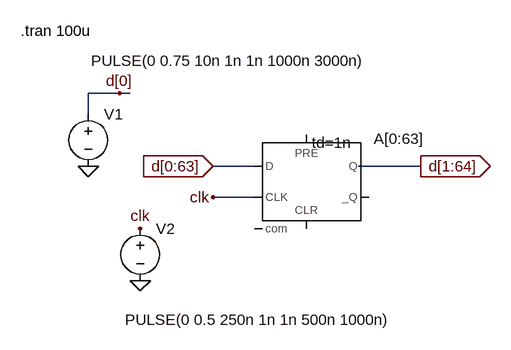
[diagram p0: schematic shiftreg64[1].asc]
shiftreg64[1].asc, the LTspice schematic file:
Version 4
SHEET 1 944 680
WIRE -96 -80 -144 -80
WIRE -80 -80 -96 -80
WIRE -144 -48 -144 -80
WIRE 112 32 48 32
WIRE 368 32 272 32
WIRE 112 80 48 80
FLAG 48 32 d[0:63]
IOPIN 48 32 In
FLAG 48 80 clk
FLAG -144 32 0
FLAG -64 208 0
FLAG -64 128 clk
FLAG -96 -80 d[0]
FLAG 368 32 d[1:64]
IOPIN 368 32 Out
SYMBOL Digital\\dflop 192 -16 R0
WINDOW 3 8 12 Left 0
SYMATTR Value td=1n
SYMATTR InstName A[0:63]
SYMBOL voltage -144 -64 R0
WINDOW 3 4 -66 Left 0
WINDOW 123 0 0 Left 0
WINDOW 39 0 0 Left 0
SYMATTR Value PULSE(0 0.75 10n 1n 1n 1000n 3000n)
SYMATTR InstName V1
SYMBOL voltage -64 112 R0
WINDOW 3 -23 156 Left 0
WINDOW 123 0 0 Left 0
WINDOW 39 0 0 Left 0
SYMATTR Value PULSE(0 0.5 250n 1n 1n 500n 1000n)
SYMATTR InstName V2
TEXT -248 -176 Left 0 !.tran 100u

The netlist it stands for:
* shiftreg64[1].asc
A[0:63] d[0:63] 0 clk 0 0 0 d[1:64] 0 DFLOP td=1n
V1 d[0] 0 PULSE(0 0.75 10n 1n 1n 1000n 3000n)
V2 clk 0 PULSE(0 0.5 250n 1n 1n 500n 1000n)
.tran 100u
.backanno
.end